# EAGLE schematic 3005_beacon_bluegiga (EAGLE 9.6.2)
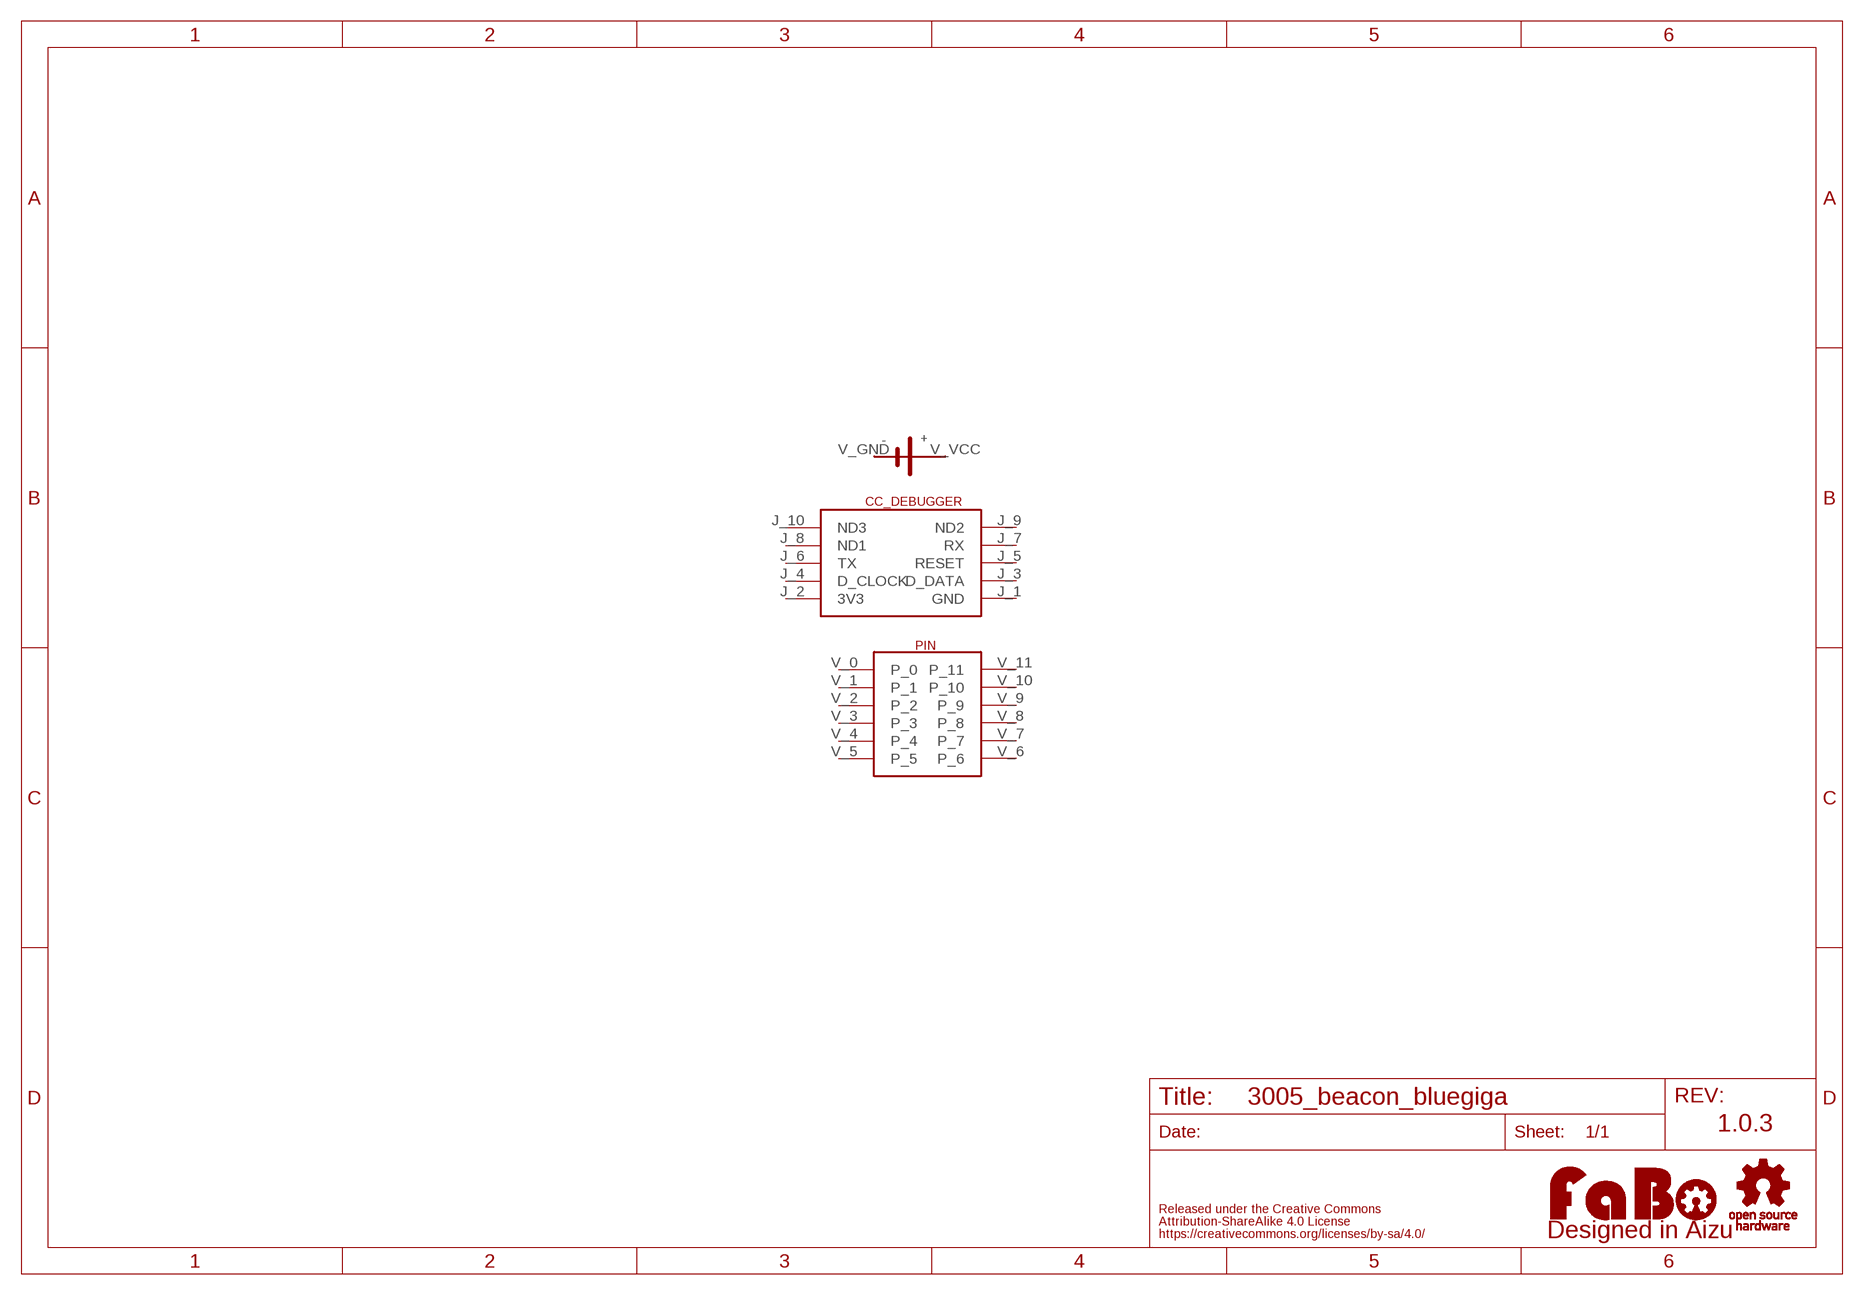
[diagram p0: schematic, sheet 1]

## Parts
U$2  FABO-BEACON-BLUEGIGA  [FABO-BEACON-BLUEGIGA]
U$3  LOGO_OSHW-M_BOTTOM  [LOGO_OSHW_M_BOTTOM]
U$4  LOGO_FABO-M  [LOGO_FABO_MS]
Unconnected: U$2.J_1(GND) U$2.J_2(3V3) U$2.J_3(D_DATA) U$2.J_4(D_CLOCK) U$2.J_5(RESET) U$2.J_6(TX) U$2.J_7(RX) U$2.J_8(ND1) U$2.J_9(ND2) U$2.J_10(ND3) U$2.V_0(P_0) U$2.V_1(P_1) U$2.V_2(P_2) U$2.V_3(P_3) U$2.V_4(P_4) U$2.V_5(P_5) U$2.V_6(P_6) U$2.V_7(P_7) U$2.V_8(P_8) U$2.V_9(P_9) U$2.V_10(P_10) U$2.V_11(P_11) U$2.V_GND(GND) U$2.V_VCC(VCC)

## Notes on the sheet
- 1.0.3

## Library data of the parts
U$2 = FaBo-Template:FABO-BEACON-BLUEGIGA
U$3 = FaBo-Logo:LOGO_OSHW
U$4 = FaBo-Logo:LOGO_FABO